# EAGLE schematic rgb-breakout (EAGLE 9.6.1)
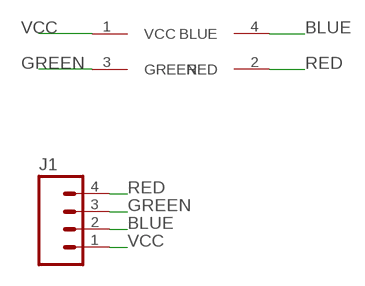
[diagram p0: schematic, sheet 1]

## Parts
J1  M04LONGPADS  [1X04_LONGPADS]
U$1  XZCMEDGCBD110W-RGB  [1.6X1.6-RGB]

## Nets
BLUE: J1.2 U$1.4(BLUE)
GREEN: J1.3 U$1.3(GREEN)
RED: J1.4 U$1.2(RED)
VCC: J1.1 U$1.1(VCC)

## Library data of the parts
J1 = connector:M04: Header 4 Standard 4-pin 0.1" header. Use with straight break away headers (SKU : PRT-00116), right angle break away headers (PRT-00553), swiss pins (PRT-00743), machine pins (PRT-00117), and female headers (PRT-00115). Molex polarized connector foot print use with SKU : PRT-08231 with associated crimp pins and housings. 1MM SMD Version SKU: PRT-10208; PROD_ID: CONN-09696
U$1 = leds:XZCMEDGCBD110W-RGB